# Altium schematic sheet IR.SchDoc
size A
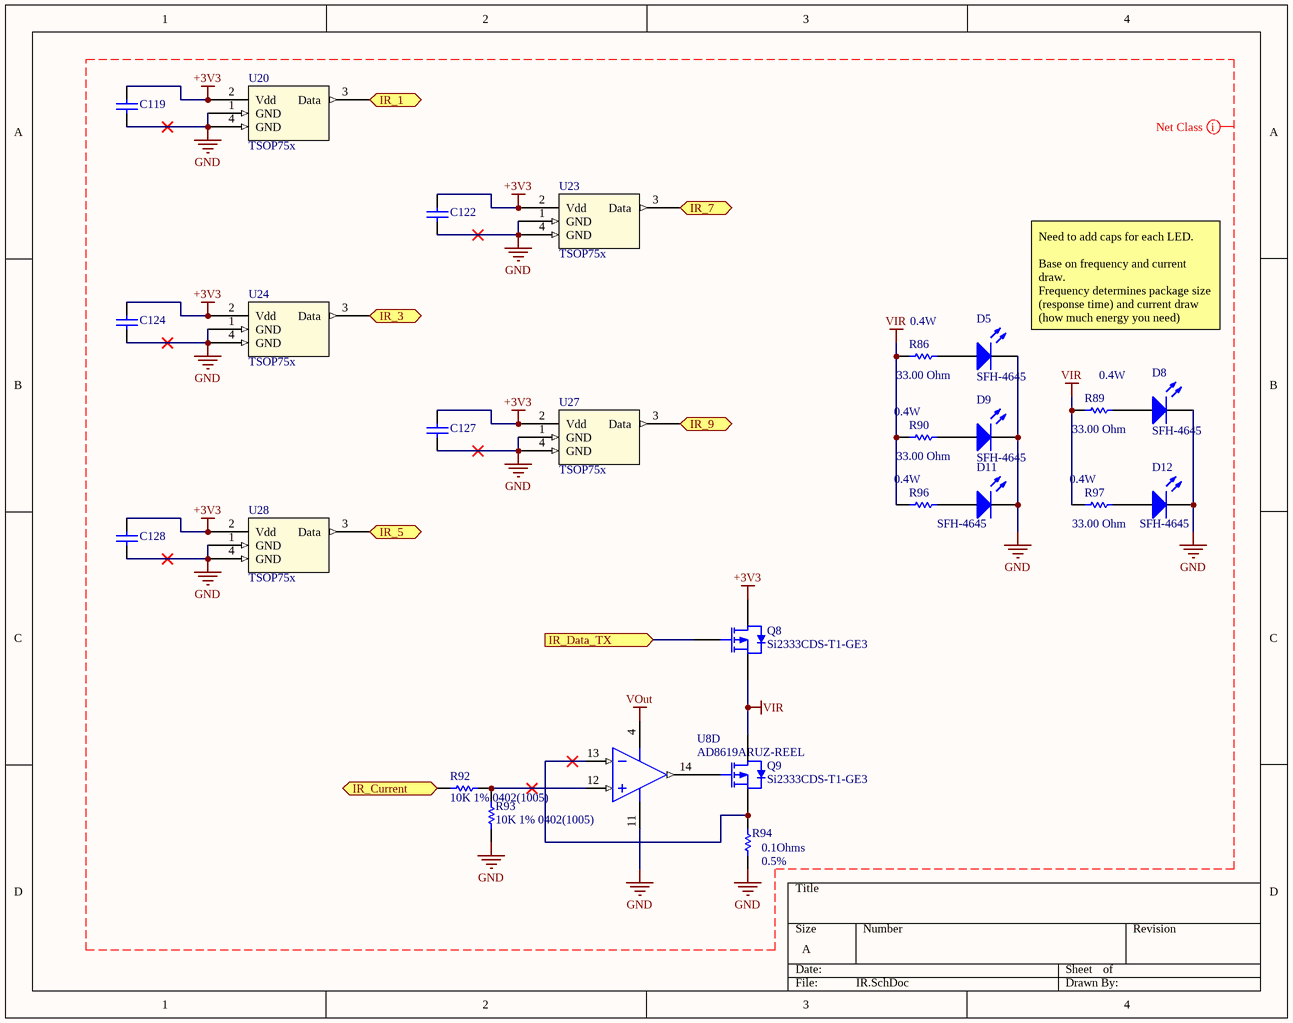
[diagram p0: IR.SchDoc]

## Parts
C119  CAP 100nF 10V 0402(1005)  [CAPC0402(1005)60_L]  (value not drawn)
C122  CAP 100nF 10V 0402(1005)  [CAPC0402(1005)60_L]  (value not drawn)
C124  CAP 100nF 10V 0402(1005)  [CAPC0402(1005)60_L]  (value not drawn)
C127  CAP 100nF 10V 0402(1005)  [CAPC0402(1005)60_L]  (value not drawn)
C128  CAP 100nF 10V 0402(1005)  [CAPC0402(1005)60_L]  (value not drawn)
D5  SFH-4645  [SFH-4645]
D8  SFH-4645  [SFH-4645]
D9  SFH-4645  [SFH-4645]
D11  SFH-4645  [SFH-4645]
D12  SFH-4645  [SFH-4645]
Q8  Si2333CDS-T1-GE3  [DIOD-SOT23-3_V]
Q9  Si2333CDS-T1-GE3  [DIOD-SOT23-3_V]
R86  value 33.00 Ohm  Power: 0.4W  [RESC0805(2012)_M]  (hidden comment: 33R 5% 0805(2012))
R89  value 33.00 Ohm  Power: 0.4W  [RESC0805(2012)_M]  (hidden comment: 33R 5% 0805(2012))
R90  value 33.00 Ohm  Power: 0.4W  [RESC0805(2012)_M]  (hidden comment: 33R 5% 0805(2012))
R92  10K 1% 0402(1005)  [RESC0402(1005)_L]
R93  10K 1% 0402(1005)  [RESC0402(1005)_L]
R94  value 0.1Ohms  Tolerance: 0.5%  [RESC1206(3216)_L]  (hidden comment: RES1206)
R96  Power: 0.4W  [RESC0805(2012)_M]  (hidden comment: 33R 5% 0805(2012))
R97  value 33.00 Ohm  Power: 0.4W  [RESC0805(2012)_M]  (hidden comment: 33R 5% 0805(2012))
U8  AD8619ARUZ-REEL  [ADI-RU-14_N]  (part D of 4)
U20  TSOP75x  [TSOP75x-TR]
U23  TSOP75x  [TSOP75x-TR]
U24  TSOP75x  [TSOP75x-TR]
U27  TSOP75x  [TSOP75x-TR]
U28  TSOP75x  [TSOP75x-TR]

## Ports
IR_1 (out), IR_3 (out), IR_5 (out), IR_7 (out), IR_9 (out), IR_Current (in), IR_Data_TX (in)

## Nets
+3V3: C119.1 C122.1 C124.1 C127.1 C128.1 Q8.3(D) U20.2(Vdd) U23.2(Vdd) U24.2(Vdd) U27.2(Vdd) U28.2(Vdd)
GND: C119.2 C122.2 C124.2 C127.2 C128.2 D5.2(K) D8.2(K) D9.2(K) D11.2(K) D12.2(K) R93.1 R94.1 U8.11(-V) U20.1(GND) U20.4(GND) U23.1(GND) U23.4(GND) U24.1(GND) U24.4(GND) U27.1(GND) U27.4(GND) U28.1(GND) U28.4(GND)
VIR: Q8.2(S) Q9.3(D) R86.1 R89.1 R90.1 R96.1 R97.1
VOut: U8.4(+V)
IR_1: U20.3(Data) ; port IR_1
IR_3: U24.3(Data) ; port IR_3
IR_5: U28.3(Data) ; port IR_5
IR_7: U23.3(Data) ; port IR_7
IR_9: U27.3(Data) ; port IR_9
IR_Current: R92.2 ; port IR_Current
IR_Data_TX: Q8.1(G) ; port IR_Data_TX
NetD5_1: D5.1(A) R86.2
NetD8_1: D8.1(A) R89.2
NetD9_1: D9.1(A) R90.2
NetD11_1: D11.1(A) R96.2
NetD12_1: D12.1(A) R97.2
NetQ9_1: Q9.1(G) U8.14(OUT_D)
NetQ9_2: Q9.2(S) R94.2 U8.13(-IN_D)
NetR92_1: R92.1 R93.2 U8.12(+IN_D)

## Layout directives
net class IR: +3V3, GND, VIR, VOut

## Notes on the sheet
- (near D5) Need to add caps for each LED.
  Base on frequency and current draw.
  Frequency determines package size (response time) and current draw (how much energy you need) determines capacity.

## Library data of the parts
C119 C122 C124 C127 C128 = CMP-1034-02066-1: CAP 100nF 10V ±20% 0402 (1005 Metric) Thickness 0.6mm SMD; Tolerance: Â±20%; Case-Metric: 1005; Case-EIA: 0402; Max Thickness: 0.6 mm; Rated Voltage: 10 V; Technology: SMT; Value: 100nF
D5 D8 D9 D11 D12 = LED3: IR LED Toplooker; Published: 8-Jun-2000; LatestRevisionDate: 17-Dec-2003; LatestRevisionNote: PCB Footprint replaced.; DatasheetVersion: 16-Apr-2002; PackageVersion: 16-Apr-2002; PackageReference: 3.5X2.8X1.9; Publisher: Altium Limited; PackageDescription: SM LED; 2 C-Bend Leads; Body 3.5 x 2.8 x 1.9 mm, inc leads (LxWxH typ)
Q8 Q9 = CMP-00020-0000-A.2: MOSFET 12V 5.1A 2.5W 35 mohms @ 4.5V; Manufacturer: Vishay; Channel Mode: Enhancement; Brand: Vishay Semiconductors; Rise Time: 35 ns; Transistor Polarity: P-Channel; Vgs - Gate-Source Voltage: 8 V; Number of Channels: 1 Channel; Pd - Power Dissipation: 1.25 W; Configuration: Single; Typical Turn-Off Delay Time: 45 ns; Transistor Type: 1 P-Channel; Vds - Drain-Source Breakdown Voltage: - 12 V; Typical Turn-On Delay Time: 13 ns; Tradename: TrenchFET; Standard Pack Qty: 3000; Reeling: True; Supplier Part Number: 781-SI2333CDS-T1-GE3; Series: SI2; Length: 3.04 mm; ComponentLink1URL: http://www.mouser.com/ds/2/427/si2333cd-244460.pdf; RoHS - Mouser: Y; Technology: Si; Width: 1.4 mm; Maximum Operating Temperature: + 150 C; Rds On - Drain-Source Resistance: 35 mOhms; Product: MOSFET Small Signal; Manufacturer Part Number: Si2333CDS-T1-GE3; Minimum Operating Temperature: - 55 C; Minimum Order Quantity: 1; Height: 1.02 mm; Supplier: Mouser; ComponentLink1Description: si2333cd-244460.pdf; Id - Continuous Drain Current: 5.1 A; Fall Time: 35 ns; Mounting Style: SMD/SMT; Package / Case: SOT-23-3; Packaging: Reel
R86 R89 R90 R96 R97 = CMP-1013-00038-1: 33R 0.125W 5% 0805 (2012 Metric)  SMD; Case-Metric: 2012; Case-EIA: 0805; Technology: SMT; Tolerance: 5 %
R92 R93 = CMP-1011-00623-1: 10K 0.063W 1% 0402 (1005 Metric)  SMD; Case-EIA: 0402; Value: 10000.00 Ohm; Case-Metric: 1005; Technology: SMT; Tolerance: 1 %; Power: 0.063 W
R94 = CMP-1591-00005-1: 1206 (3216 Metric) Chip Resistor; Case-Metric: 3216; Case-EIA: 1206; PackageReference: RESC1206(3216)
U8 = CMP-0384-01896-1: Quad Channel Single-Supply Operation Operational Amplifier, 400 KHz BW, 100 mV/us SR, Industrial, 14-pin SOP (RU-14), Reel; Generic Part Number: AD8619; Manufacturer: Analog Devices; Iq/Amp: 38uA; V Span Max: 5V; V Span Min: 1.8V; Input Bias Current: 200fA; Amplifiers Per Package: 4; Input Offset Voltage: 400uV; Small Signal Bandwidth: 400KHz; ComponentLink2Description: Datasheet; Mounting Technology: Surface Mount; PackageDescription: 14-Pin Thin Shrink Small Outline Package, Body 5 x 4.4 mm, Pitch 0.65 mm; DatasheetVersion: Rev. E; Code_JEDEC: MO-153AB-1; ComponentLink2URL: http://www.analog.com/static/imported-files/data_sheets/AD8613_8617_8619.pdf; ComponentLink3URL: http://www.analog.com/static/imported-files/packages/36057385283879153717235186773RU14.pdf; ComponentLink1Description: Manufacturer URL; ComponentLink3Description: Package Specification; Slew Rate: 100mV/us; ComponentLink1URL: http://www.analog.com/en/index.html; PartNumber: AD8619ARUZ-REEL; PackageReference: RU-14; PartId: 1
U20 U23 U24 U27 U28 = TSOP75x: miniaturized SMD IR receiver  modules for infrared remote control systems